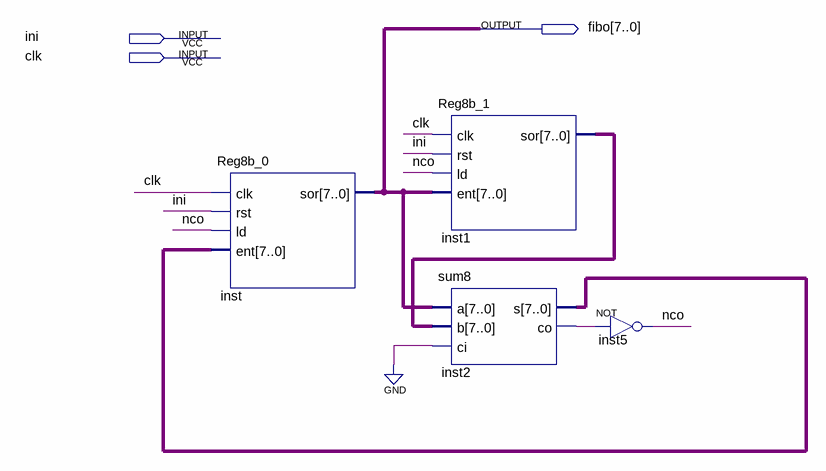
[diagram p0: schematic sheet]
// Quartus schematic 2021TG12.bdf as structural Verilog: 4 symbols, 3 pins
module \2021TG12  (
  input  ini,
  input  clk,
  output [7:0] fibo
);

  wire inst2_co, nco;
  wire [7:0] inst1_sor, inst2_s;

  Reg8b_0 inst (.clk(clk), .rst(ini), .ld(nco), .ent(inst2_s), .sor(fibo));
  Reg8b_1 inst1 (.clk(clk), .rst(ini), .ld(nco), .ent(fibo), .sor(inst1_sor));
  sum8 inst2 (.a(fibo), .b(inst1_sor), .ci(1'b0), .s(inst2_s), .co(inst2_co));
  not inst5 (nco, inst2_co);
endmodule
